# Altium schematic sheet 12LED.SchDoc
size B; SheetNumber: 7; SheetTotal: 8
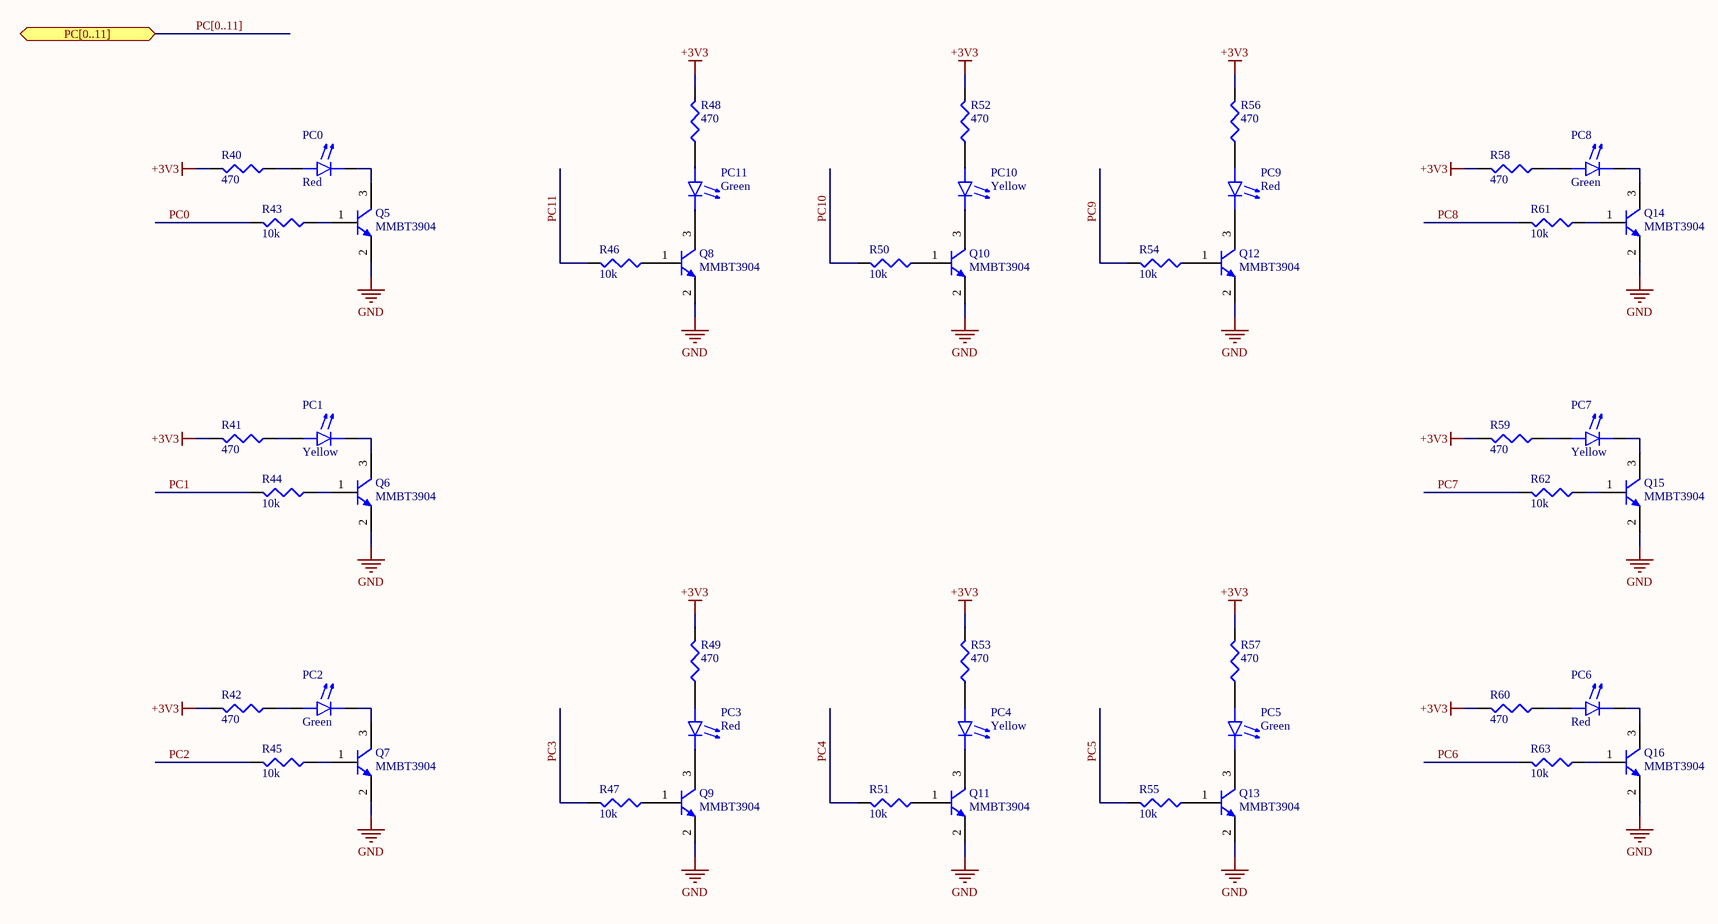
[diagram p0: 12LED.SchDoc]

## Parts
PC0  Red  [0805 (2012 Metric) Red]
PC1  Yellow  [0805 (2012 Metric) Yellow]
PC2  Green  [0805 (2012 Metric) Green]
PC3  Red  [0805 (2012 Metric) Red]
PC4  Yellow  [0805 (2012 Metric) Yellow]
PC5  Green  [0805 (2012 Metric) Green]
PC6  Red  [0805 (2012 Metric) Red]
PC7  Yellow  [0805 (2012 Metric) Yellow]
PC8  Green  [0805 (2012 Metric) Green]
PC9  Red  [0805 (2012 Metric) Red]
PC10  Yellow  [0805 (2012 Metric) Yellow]
PC11  Green  [0805 (2012 Metric) Green]
Q5  MMBT3904  [FAIR-SOT23-3_V]
Q6  MMBT3904  [FAIR-SOT23-3_V]
Q7  MMBT3904  [FAIR-SOT23-3_V]
Q8  MMBT3904  [FAIR-SOT23-3_V]
Q9  MMBT3904  [FAIR-SOT23-3_V]
Q10  MMBT3904  [FAIR-SOT23-3_V]
Q11  MMBT3904  [FAIR-SOT23-3_V]
Q12  MMBT3904  [FAIR-SOT23-3_V]
Q13  MMBT3904  [FAIR-SOT23-3_V]
Q14  MMBT3904  [FAIR-SOT23-3_V]
Q15  MMBT3904  [FAIR-SOT23-3_V]
Q16  MMBT3904  [FAIR-SOT23-3_V]
R40  value 470  [0805 (2012 Metric)]  (hidden comment: 220)
R41  value 470  [0805 (2012 Metric)]  (hidden comment: 220)
R42  value 470  [0805 (2012 Metric)]  (hidden comment: 220)
R43  value 10k  [0805 (2012 Metric)]  (hidden comment: 3k3)
R44  value 10k  [0805 (2012 Metric)]  (hidden comment: 3k3)
R45  value 10k  [0805 (2012 Metric)]  (hidden comment: 3k3)
R46  value 10k  [0805 (2012 Metric)]  (hidden comment: 3k3)
R47  value 10k  [0805 (2012 Metric)]  (hidden comment: 3k3)
R48  value 470  [0805 (2012 Metric)]  (hidden comment: 220)
R49  value 470  [0805 (2012 Metric)]  (hidden comment: 220)
R50  value 10k  [0805 (2012 Metric)]  (hidden comment: 3k3)
R51  value 10k  [0805 (2012 Metric)]  (hidden comment: 3k3)
R52  value 470  [0805 (2012 Metric)]  (hidden comment: 220)
R53  value 470  [0805 (2012 Metric)]  (hidden comment: 220)
R54  value 10k  [0805 (2012 Metric)]  (hidden comment: 3k3)
R55  value 10k  [0805 (2012 Metric)]  (hidden comment: 3k3)
R56  value 470  [0805 (2012 Metric)]  (hidden comment: 220)
R57  value 470  [0805 (2012 Metric)]  (hidden comment: 220)
R58  value 470  [0805 (2012 Metric)]  (hidden comment: 220)
R59  value 470  [0805 (2012 Metric)]  (hidden comment: 220)
R60  value 470  [0805 (2012 Metric)]  (hidden comment: 220)
R61  value 10k  [0805 (2012 Metric)]  (hidden comment: 3k3)
R62  value 10k  [0805 (2012 Metric)]  (hidden comment: 3k3)
R63  value 10k  [0805 (2012 Metric)]  (hidden comment: 3k3)

## Ports
PC[0..11] (bidir)

## Nets
+3V3: R40.2 R41.2 R42.2 R48.2 R49.2 R52.2 R53.2 R56.2 R57.2 R58.2 R59.2 R60.2
GND: Q5.2(E) Q6.2(E) Q7.2(E) Q8.2(E) Q9.2(E) Q10.2(E) Q11.2(E) Q12.2(E) Q13.2(E) Q14.2(E) Q15.2(E) Q16.2(E)
PC0: R43.2
PC1: R44.2
PC2: R45.2
PC3: R47.2
PC4: R51.2
PC5: R55.2
PC6: R63.2
PC7: R62.2
PC8: R61.2
PC9: R54.2
PC10: R50.2
PC11: R46.2
NetPC0_1: PC0.1(K) Q5.3(C)
NetPC0_2: PC0.2(A) R40.1
NetPC1_1: PC1.1(K) Q6.3(C)
NetPC1_2: PC1.2(A) R41.1
NetPC2_1: PC2.1(K) Q7.3(C)
NetPC2_2: PC2.2(A) R42.1
NetPC3_1: PC3.1(K) Q9.3(C)
NetPC3_2: PC3.2(A) R49.1
NetPC4_1: PC4.1(K) Q11.3(C)
NetPC4_2: PC4.2(A) R53.1
NetPC5_1: PC5.1(K) Q13.3(C)
NetPC5_2: PC5.2(A) R57.1
NetPC6_1: PC6.1(K) Q16.3(C)
NetPC6_2: PC6.2(A) R60.1
NetPC7_1: PC7.1(K) Q15.3(C)
NetPC7_2: PC7.2(A) R59.1
NetPC8_1: PC8.1(K) Q14.3(C)
NetPC8_2: PC8.2(A) R58.1
NetPC9_1: PC9.1(K) Q12.3(C)
NetPC9_2: PC9.2(A) R56.1
NetPC10_1: PC10.1(K) Q10.3(C)
NetPC10_2: PC10.2(A) R52.1
NetPC11_1: PC11.1(K) Q8.3(C)
NetPC11_2: PC11.2(A) R48.1
NetQ5_1: Q5.1(B) R43.1
NetQ6_1: Q6.1(B) R44.1
NetQ7_1: Q7.1(B) R45.1
NetQ8_1: Q8.1(B) R46.1
NetQ9_1: Q9.1(B) R47.1
NetQ10_1: Q10.1(B) R50.1
NetQ11_1: Q11.1(B) R51.1
NetQ12_1: Q12.1(B) R54.1
NetQ13_1: Q13.1(B) R55.1
NetQ14_1: Q14.1(B) R61.1
NetQ15_1: Q15.1(B) R62.1
NetQ16_1: Q16.1(B) R63.1

## Buses and harness runs
bus PC[0..11] = port PC[0..11]

## Library data of the parts
PC0-PC11 = CMP-007-00046-3: Oreki; ComponentLink1Description: DigiKey
  PC0 PC3 PC6 PC9: JLCPCB Part #: C142306
  PC1 PC4 PC7 PC10: JLCPCB Part #: C2296
  PC2 PC5 PC8 PC11: JLCPCB Part #: C389524
Q5-Q16 = CMP-014-00026-4: NPN General Purpose Amplifier, 40 V, 0.2 A, -55 to 150 degC, 3-Pin SOT23, RoHS, Tape and Reel; Manufacturer: Fairchild Semiconductor; Frequency: 300MHz; Elements: 1; Vce Max: 300mV; hFE Min: 100; Package Version: Rev. 12, 03/2016; Power: 625mW; Manufacturer URL: https://www.fairchildsemi.com/; JLCPCB Part #: C20526; Package Quantity: 3000; Case/Package: TO-236-3; Pins: 3; Package Reference: SOT23-3; Min Operating Temperature: -55°C; Package Description: 3-Pin Small Outline Transistor, Body 2.92 x 1.325 mm, Pitch 0.95 mm; Package URL: http://www.fairchildsemi.com/dwg/MA/MA03D.pdf; RoHS Compliant: True; Max Operating Temperature: 150°C; Mounting Technology: SM; Packaging: TapeandReel; Datasheet Version: Rev. 1.1.0, 10/2014; Datasheet URL: https://www.fairchildsemi.com/datasheets/MM/MMBT3904.pdf
R40-R63 = CMP-009-00179-13: Oreki; ComponentLink1Description: DigiKey; RoHS Compliant: Yes; Mounting Technology: SMT; Pins: 2; Case/Package: Chip